# EAGLE schematic EG (EAGLE 7.5.0)
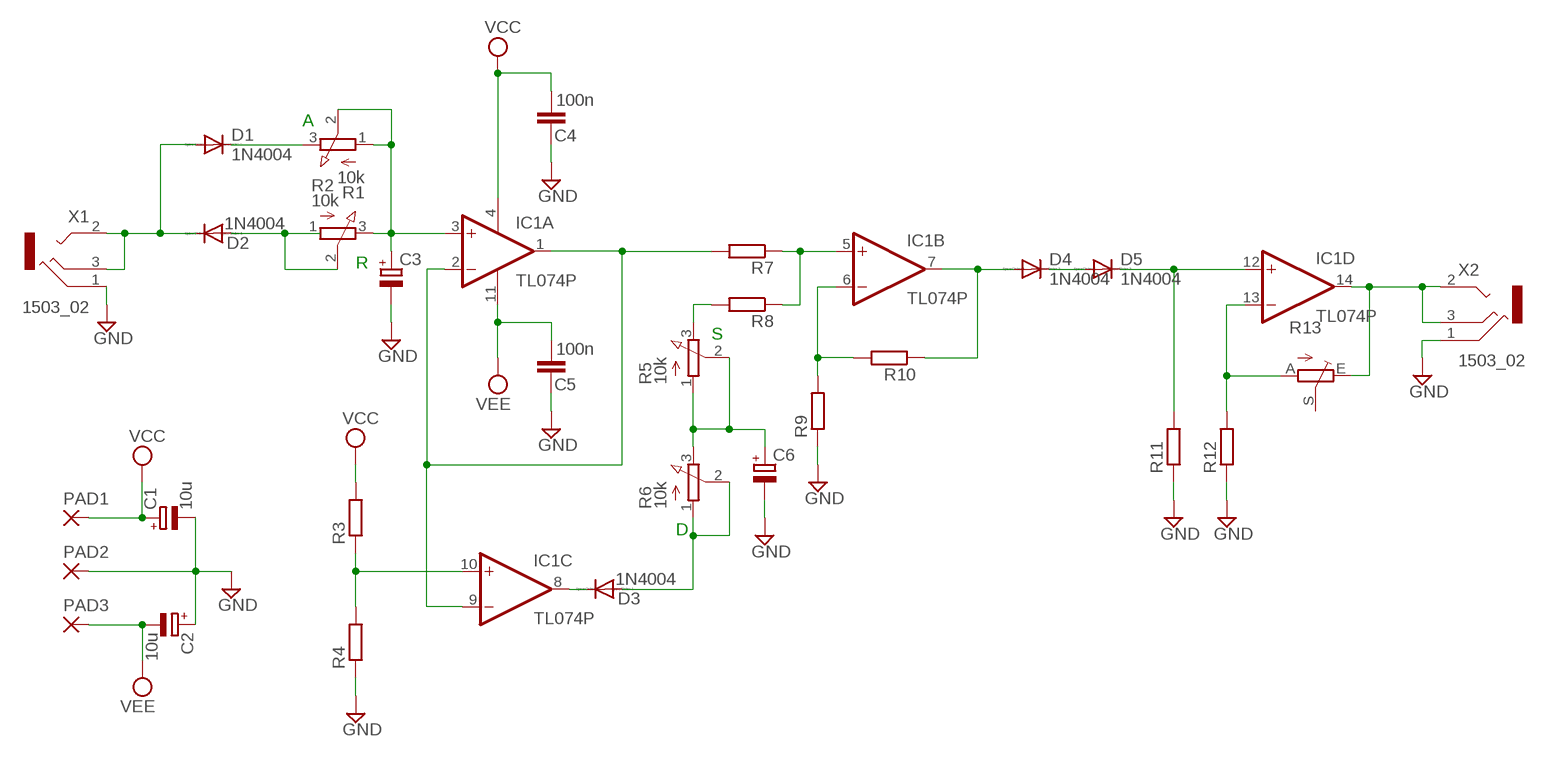
[diagram p0: schematic, sheet 1]

## Parts
C1  10u  CPOL-EUE2.5-7  [E2,5-7]
C2  10u  CPOL-EUE2.5-7  [E2,5-7]
C3  CPOL-EUE2.5-6  [E2,5-6]
C4  100n  C5/2.5  [C5B2.5]
C5  100n  C5/2.5  [C5B2.5]
C6  CPOL-EUE2.5-6  [E2,5-6]
D1  1N4004  [DO41-10]
D2  1N4004  [DO41-10]
D3  1N4004  [DO41-10]
D4  1N4004  [DO41-10]
D5  1N4004  [DO41-10]
IC1  TL074P  [DIL14]
PAD1  3,17/1,1  [3,17/1,1]
PAD2  3,17/1,1  [3,17/1,1]
PAD3  3,17/1,1  [3,17/1,1]
R1  10k  3RP/1610N  [3RP/1610N]
R2  10k  3RP/1610N  [3RP/1610N]
R3  R-EU_0207/10  [0207/10]
R4  R-EU_0207/10  [0207/10]
R5  10k  3RP/1610N  [3RP/1610N]
R6  10k  3RP/1610N  [3RP/1610N]
R7  R-EU_0207/10  [0207/10]
R8  R-EU_0207/10  [0207/10]
R9  R-EU_0207/10  [0207/10]
R10  R-EU_0207/10  [0207/10]
R11  R-EU_0207/10  [0207/10]
R12  R-EU_0207/10  [0207/10]
R13  TRIM_EU-S75P  [S75P]
X1  1503_02  [1503_02]
X2  1503_02  [1503_02]

## Nets
GND: C1.- C2.+ C3.- C4.1 C5.1 C6.- PAD2.1(P) R4.1 R9.1 R11.1 R12.1 X1.1 X2.1
N$1: D1.A D2.C X1.2 X1.3
N$2: D2.A R2.1(A) R2.2(S)
N$3: IC1.1(A:OUT) IC1.2(A:-IN) IC1.9(C:-IN) R7.2
N$4: D1.C R1.3(E)
N$5: IC1.6(B:-IN) R9.2 R10.2
N$6: D4.A IC1.7(B:OUT) R10.1
N$7: IC1.5(B:+IN) R7.1 R8.1
N$8: C3.+ IC1.3(A:+IN) R1.1(A) R1.2(S) R2.3(E)
N$9: R5.3(E) R8.2
N$10: C6.+ R5.1(A) R5.2(S) R6.3(E)
N$12: D3.A R6.1(A) R6.2(S)
N$13: D3.C IC1.8(C:OUT)
N$15: IC1.10(C:+IN) R3.1 R4.2
N$16: D4.C D5.A
N$17: D5.C IC1.12(D:+IN) R11.2
N$18: IC1.13(D:-IN) R12.2 R13.A
N$19: IC1.14(D:OUT) R13.E X2.2 X2.3
VCC: C1.+ C4.2 IC1.4(P:V+) PAD1.1(P) R3.2
VEE [Power]: C2.- C5.2 IC1.11(P:V-) PAD3.1(P)
Unconnected: R13.S X1.2@2 X2.2@2

## Notes on the sheet
- A
- R
- S
- D

## Library data of the parts
C1-C3 C6 = rcl:CPOL-EU: POLARIZED CAPACITOR, European symbol
C4 C5 = capacitor-wima:C: CAPACITOR naming: grid - package width
D1-D5 = diode:1N4004: DIODE general purpose rectifier, 1 A
IC1 = linear:TL074: OP AMP
PAD1-PAD3 = wirepad:3,17/1,1: THROUGH-HOLE PAD
R1 R2 R5 R6 = pot:3RP/1610N: 16mm Potentiometer one level Source: http://www.alphapotentiometers.net/html/16mm_pot_2.html
R3 R4 R7-R12 = rcl:R-EU_: RESISTOR, European symbol
R13 = pot:TRIM_EU-: POTENTIOMETER
X1 X2 = con-lumberg:1503_02: Jack connectors according to JISC 6560, 3.5 mm Klinkeneinbaukupplung nach JISC 6560, 3,5 mm, 3-polig/stereo, abgewinkelte Ausführung, Surface-Mount-Technik (SMT) Source: http://www.lumberg.com/Produkte/PDFs/1503_02.pdf; OC_FARNELL: 1216979; OC_NEWARK: unknown

## Net classes
0 default: width 0.508 mm, clearance 0.508 mm
1 Power: width 1.016 mm, clearance 0.508 mm